# EAGLE design nRF24L01 Proto Board (EAGLE 7.2.0)
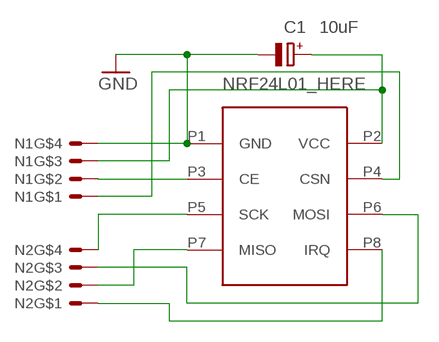
[diagram p0: schematic, sheet 1]

## Parts
C1  10uF  CPOL-EUE2.5-6  [E2,5-6]
N1  4PINHEADER_S  [4PINHEADER_S]
N2  4PINHEADER_S  [4PINHEADER_S]
NRF24L01_HERE  NRF24L01A  [NRF24L01]

## Nets
GND: C1.- N1.N3 NRF24L01_HERE.P1(GND)
N$1: N1.N0 NRF24L01_HERE.P4(CSN)
N$2: N1.N1 NRF24L01_HERE.P3(CE)
N$3: N2.N3 NRF24L01_HERE.P5(SCK)
N$4: N2.N2 NRF24L01_HERE.P6(MOSI)
N$5: C1.+ N1.N2 NRF24L01_HERE.P2(VCC)
N$6: N2.N1 NRF24L01_HERE.P7(MISO)
N$7: N2.N0 NRF24L01_HERE.P8(IRQ)

## Library data of the parts
C1 = rcl:CPOL-EU: POLARIZED CAPACITOR, European symbol
N1 N2 = ForceTronics:4PINHEADER_S: 4 Pin Connector 0.1" Spacing Round Copper
NRF24L01_HERE = ForceTronics:NRF24L01

## Board
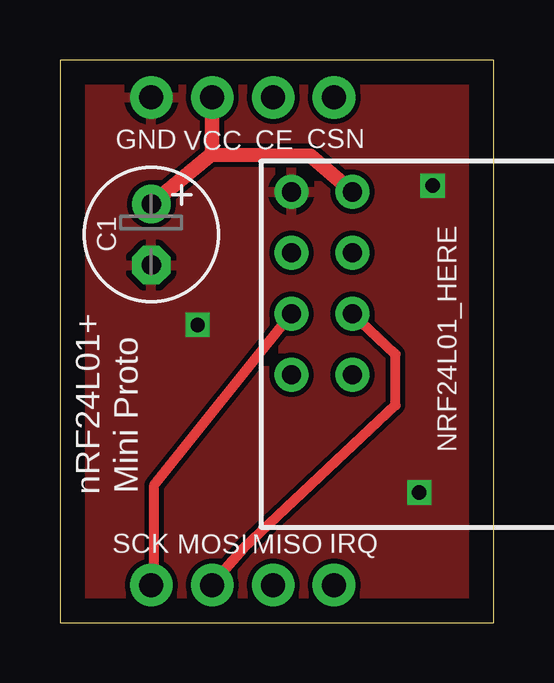
[diagram p1: board, top side]
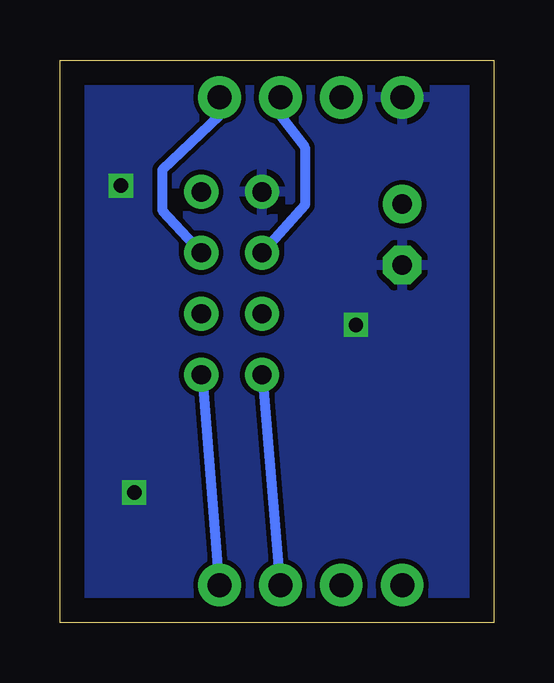
[diagram p2: board, bottom side, seen from below]

Size 18.09 x 23.45 mm. Coordinates in mm from the lower left corner, seen from the top.
Outline: 0,0 18.09,0 18.09,23.45 0,23.45 0,0
Copper layers (1*16): Top 0.035mm / dielectric 1.5mm / Bottom 0.035mm
Design rules "default": minimum track width 10mil, minimum drill 24mil, track to track 8mil, track to pad 8mil, pad to pad 8mil, via to via 8mil, smd to smd 8mil, copper to edge 40mil, drill to drill 8mil, minimum pad ring 10mil, minimum via ring 8mil, stop-mask expansion 4mil, vias tented up to drill 0mil, thermal gap 10mil

### Footprints (pad centres in the part's own frame; a part is rotated, then mirrored left to right if it is on the bottom)
E2,5-6 = drill 0.813 pad 1.6: + -1.27,0 | drill 0.813 pad 1.6 octagon: - 1.27,0
4PINHEADER_S = drill 1 pad 1.778: N0 1.27,3.81; N1 3.81,3.81; N2 6.35,3.81; N3 8.89,3.81
NRF24L01 = drill 0.8 pad 1.422: P1 13.97,-1.27; P2 13.97,-3.81; P3 11.43,-1.27; P4 11.43,-3.81; P5 8.89,-1.27; P6 8.89,-3.81; P7 6.35,-1.27; P8 6.35,-3.81

### Placement (x,y rotation side)
C1  3.81,16.18 270 top
N1  12.7,25.7 180 top
N2  12.7,5.38 180 top
NRF24L01_HERE  8.38,3.98 90 top

### Tracks (layer width: path | path; a pad name or v marks a point on that pad's centre or on a via)
GND  (via drill 0.6)
  other vias: 5.74,12.42 14.99,5.43 15.54,18.22
  pour Bottom: -2.54,25.7 -2.54,-2.24 20.32,-2.24 20.32,25.7
  pour Top: -2.54,25.7 -2.54,-2.24 20.32,-2.24 20.32,25.7
N$1
  Bottom 0.406: N1.N0 11.46,21.89 11.46,21.13 13.82,18.87 13.82,17.19 12.19,15.44 NRF24L01_HERE.P4
N$2
  Bottom 0.406: N1.N1 8.89,21.13 7.87,19.81 7.87,17.39 9.65,15.39 NRF24L01_HERE.P3
N$3
  Top 0.406: N2.N3 3.94,1.57 3.94,5.74 NRF24L01_HERE.P5
N$4
  Top 0.406: N2.N2 6.3,1.57 7.67,3.12 13.99,9.06 13.99,11.2 NRF24L01_HERE.P6
N$5
  Top 0.61: C1.+ 6.33,19.53 6.35,19.5 | 6.35,19.5 N1.N2 | 6.35,19.5 10.44,19.45 NRF24L01_HERE.P2
N$6
  Bottom 0.406: N2.N1 9.63,10.21 NRF24L01_HERE.P7
N$7
  Bottom 0.406: N2.N0 12.14,10.36 NRF24L01_HERE.P8

### Text on the board
tNames: GND | VCC | CE | CSN | nRF24L01+ | Mini Proto | SCK | MOSI | MISO | IRQ